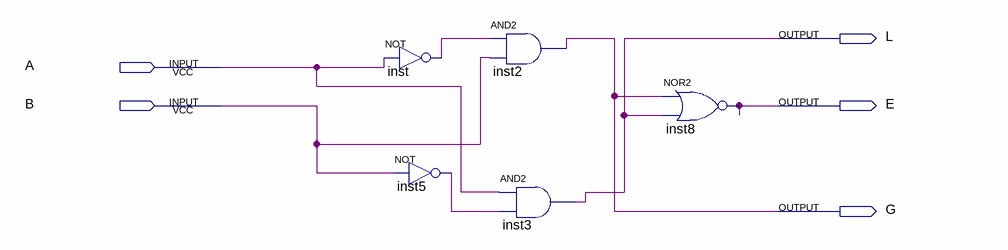
[diagram p0: schematic sheet]
// Quartus schematic comparator_signed1bit.bdf as structural Verilog: 5 symbols, 5 pins
module comparator_signed1bit (
  input  A,
  input  B,
  output L,
  output E,
  output G
);

  wire inst5_out, inst_out;

  not inst (inst_out, A);
  not inst5 (inst5_out, B);
  and inst2 (G, inst_out, B);
  and inst3 (L, A, inst5_out);
  nor inst8 (E, G, L);
endmodule
